# Altium project Codec_board.PrjPCB
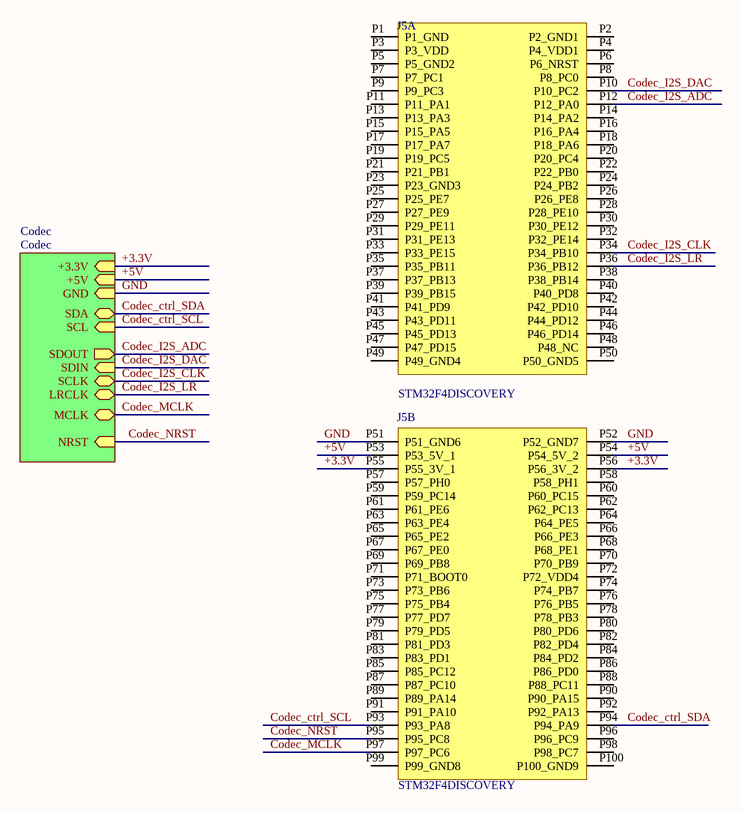
[diagram p0: Codec_board.SchDoc]
5 sheets, 116 parts. Net scope: hierarchical (ports join the sheet entries above them; power ports are global).
Board files: Codec_board_V0.PcbDoc, Codec_board.PcbDoc
Sheets:
  Codec_board.SchDoc
    Codec = Codec.SchDoc
      Input = Input_stage.SchDoc
      Output = Output_stage.SchDoc
      Power = Power_18.SchDoc

## Sheet Codec_board.SchDoc
size A0

### Parts
J5  STM32F4DISCOVERY  [STMICROELECTRONICS_STM32F4DISCOVERY_STM32F4DISCOVERY]  (parts A,B of 2)

### Sub-sheets
Codec = Codec: SDOUT (out), SCLK (bidir), MCLK (bidir), SDA (bidir), SCL (in), +3.3V (in), SDIN (in), GND (in), LRCLK (bidir), +5V (in), NRST (in)

### Nets
+3.3V: J5.P55(P55_3V_1) J5.P56(P56_3V_2) ; sheet Codec/+3.3V
+5V: J5.P53(P53_5V_1) J5.P54(P54_5V_2) ; sheet Codec/+5V
GND: J5.P51(P51_GND6) J5.P52(P52_GND7) ; sheet Codec/GND
Codec_ctrl_SCL: J5.P93(P93_PA8) ; sheet Codec/SCL
Codec_ctrl_SDA: J5.P94(P94_PA9) ; sheet Codec/SDA
Codec_I2S_ADC: J5.P12(P12_PA0) ; sheet Codec/SDOUT
Codec_I2S_CLK: J5.P34(P34_PB10) ; sheet Codec/SCLK
Codec_I2S_DAC: J5.P10(P10_PC2) ; sheet Codec/SDIN
Codec_I2S_LR: J5.P36(P36_PB12) ; sheet Codec/LRCLK
Codec_MCLK: J5.P97(P97_PC6) ; sheet Codec/MCLK
Codec_NRST: J5.P95(P95_PC8) ; sheet Codec/NRST

Not connected (* = marked no-connect by the designer): J5 P1(P1_GND) P2(P2_GND1) P3(P3_VDD) P4(P4_VDD1) P5(P5_GND2) P6(P6_NRST) P7(P7_PC1) P8(P8_PC0) P9(P9_PC3) P11(P11_PA1) P13(P13_PA3) P14(P14_PA2) P15(P15_PA5) P16(P16_PA4) P17(P17_PA7) P18(P18_PA6) P19(P19_PC5) P20(P20_PC4) P21(P21_PB1) P22(P22_PB0) P23(P23_GND3) P24(P24_PB2) P25(P25_PE7) P26(P26_PE8) P27(P27_PE9) P28(P28_PE10) P29(P29_PE11) P30(P30_PE12) P31(P31_PE13) P32(P32_PE14) P33(P33_PE15) P35(P35_PB11) P37(P37_PB13) P38(P38_PB14) P39(P39_PB15) P40(P40_PD8) P41(P41_PD9) P42(P42_PD10) P43(P43_PD11) P44(P44_PD12) P45(P45_PD13) P46(P46_PD14) P47(P47_PD15) P48(P48_NC) P49(P49_GND4) P50(P50_GND5) P57(P57_PH0) P58(P58_PH1) P59(P59_PC14) P60(P60_PC15) P61(P61_PE6) P62(P62_PC13) P63(P63_PE4) P64(P64_PE5) P65(P65_PE2) P66(P66_PE3) P67(P67_PE0) P68(P68_PE1) P69(P69_PB8) P70(P70_PB9) P71(P71_BOOT0) P72(P72_VDD4) P73(P73_PB6) P74(P74_PB7) P75(P75_PB4) P76(P76_PB5) P77(P77_PD7) P78(P78_PB3) P79(P79_PD5) P80(P80_PD6) P81(P81_PD3) P82(P82_PD4) P83(P83_PD1) P84(P84_PD2) P85(P85_PC12) P86(P86_PD0) P87(P87_PC10) P88(P88_PC11) P89(P89_PA14) P90(P90_PA15) P91(P91_PA10) P92(P92_PA13) P96(P96_PC9) P98(P98_PC7) P99(P99_GND8) P100(P100_GND9)

### Library data of the parts
J5 = STM32F4DISCOVERY: Development kit: ARM ST; pin strips, pin header; No.of; MF: STMicroelectronics; MP: STM32F4DISCOVERY; Availability: Unavailable; SnapEDA_Link: https://www.snapeda.com/parts/STM32F4DISCOVERY/STMicroelectronics/view-part/?ref=snap; Package: None; Price: None; Value: *

## Sheet Codec.SchDoc
size A0
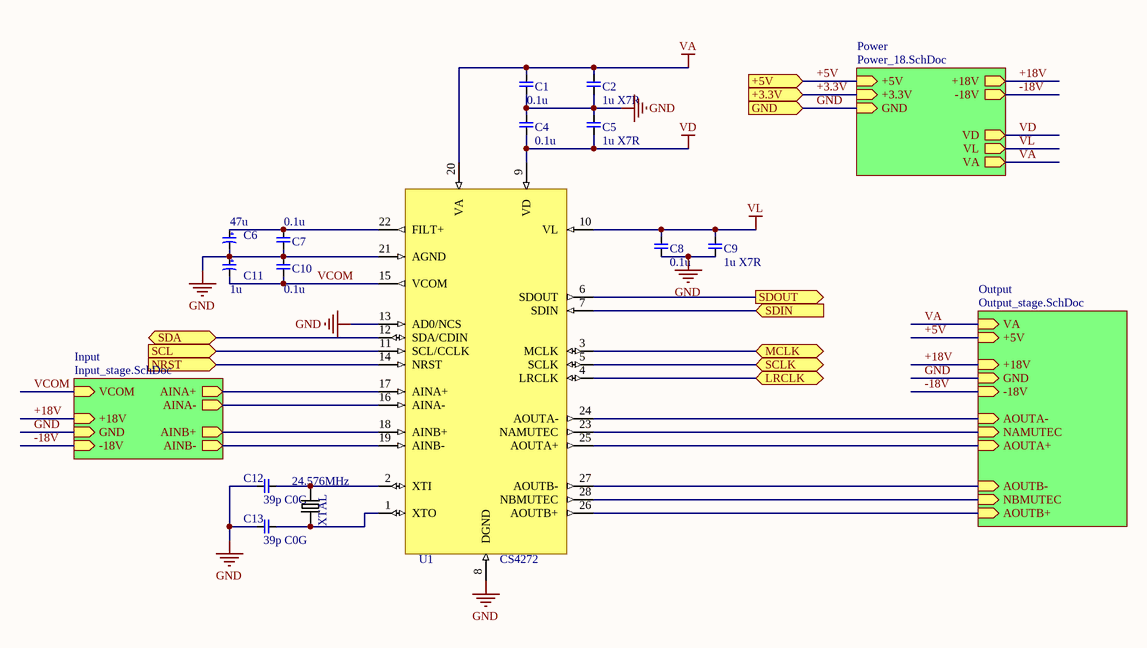
[diagram p1: Codec.SchDoc]

### Parts
24.576MHz  XTAL  [XTAL_hc-49_smd]
C1  0.1u  [0805_cap]
C2  1u X7R  [0805_cap]
C4  0.1u  [0805_cap]
C5  1u X7R  [0805_cap]
C6  47u  [cap 4x5.4]
C7  0.1u  [0805_cap]
C8  0.1u  [0805_cap]
C9  1u X7R  [0805_cap]
C10  0.1u  [0805_cap]
C11  1u  [cap 4x5.4]
C12  39p C0G  [0805_cap]
C13  39p C0G  [0805_cap]
U1  CS4272  [TSSOP-28]

### Sub-sheets
Input = Input_stage.SchDoc: AINA+ (out), AINB+ (out), +18V (in), GND (in), VCOM (in), AINB- (out), AINA- (out), -18V (in)
Output = Output_stage.SchDoc: NAMUTEC (in), AOUTA+ (in), -18V (in), GND (in), +5V (in), NBMUTEC (in), AOUTA- (in), VA (in), AOUTB- (in), +18V (in), AOUTB+ (in)
Power = Power_18.SchDoc: +3.3V (in), GND (in), -18V (out), +18V (out), VD (out), VL (out), VA (out), +5V (in)

### Ports
+3.3V (in), +5V (in), GND (in), LRCLK (bidir), MCLK (bidir), NRST (in), SCL (in), SCLK (bidir), SDA (bidir), SDIN (in), SDOUT (out)

### Nets
+3.3V: port +3.3V, sheet Power/+3.3V
+5V: C1.2 C2.2 U1.20(VA) ; port +5V, sheet Output/+5V, sheet Output/VA, sheet Power/VA, sheet Power/+5V  [also labelled VA]
+18V: sheet Input/+18V, sheet Output/+18V, sheet Power/+18V
-18V: sheet Input/-18V, sheet Output/-18V, sheet Power/-18V
GND: C1.1 C2.1 C4.2 C5.2 C6.2 C7.1 C8.1 C9.1 C10.2 C11.1 C12.1 C13.1 U1.8(DGND) U1.13(AD0/NCS) U1.21(AGND) ; port GND, sheet Input/GND, sheet Output/GND, sheet Power/GND
VD: C4.1 C5.1 U1.9(VD) ; sheet Power/VD
VL: C8.2 C9.2 U1.10(VL) ; sheet Power/VL
Codec_ctrl_SCL: U1.11(SCL/CCLK) ; port SCL
Codec_ctrl_SDA: U1.12(SDA/CDIN) ; port SDA
Codec_I2S_ADC: U1.6(SDOUT) ; port SDOUT
Codec_I2S_CLK: U1.5(SCLK) ; port SCLK
Codec_I2S_DAC: U1.7(SDIN) ; port SDIN
Codec_I2S_LR: U1.4(LRCLK) ; port LRCLK
Codec_MCLK: U1.3(MCLK) ; port MCLK
Codec_NRST: U1.14(NRST) ; port NRST
VCOM: C10.1 C11.2 U1.15(VCOM) ; sheet Input/VCOM
Net24.576MHz_1: 24.576MHz.1 C13.2 U1.1(XTO)
Net24.576MHz_2: 24.576MHz.2 C12.2 U1.2(XTI)
NetC6_1: C6.1 C7.2 U1.22(FILT+)
NetC17_1: U1.16(AINA-) ; sheet Input/AINA-
NetC17_2: U1.17(AINA+) ; sheet Input/AINA+
NetC25_1: U1.19(AINB-) ; sheet Input/AINB-
NetC25_2: U1.18(AINB+) ; sheet Input/AINB+
NetQ1_1: U1.23(NAMUTEC) ; sheet Output/NAMUTEC
NetQ3_1: U1.28(NBMUTEC) ; sheet Output/NBMUTEC
NetR18_1: U1.24(AOUTA-) ; sheet Output/AOUTA-
NetR21_1: U1.25(AOUTA+) ; sheet Output/AOUTA+
NetR29_1: U1.27(AOUTB-) ; sheet Output/AOUTB-
NetR32_1: U1.26(AOUTB+) ; sheet Output/AOUTB+

### Library data of the parts
24.576MHz = hc-49_smd: Crystal 4MHz ?30ppm (Tol) ?50ppm (Stability) 20pF FUND 200Ohm 2-Pin HC-49/SDLF SMD T/R; MP: FOXSDLF/040; MF: Fox Electronics; Availability: Good; Price: 0.34 USD; Package: HC49SD Fox Electronics; SnapEDA_Link: https://www.snapeda.com/symbols-footprints/FOXSDLF/040/Fox%20Electronics/view-part/?ref=snap; Value: *
C1 C2 C4 C5 C7-C10 C12 C13 = Cap
C6 C11 = Cap_electrolytic

## Sheet Input_stage.SchDoc
size A0
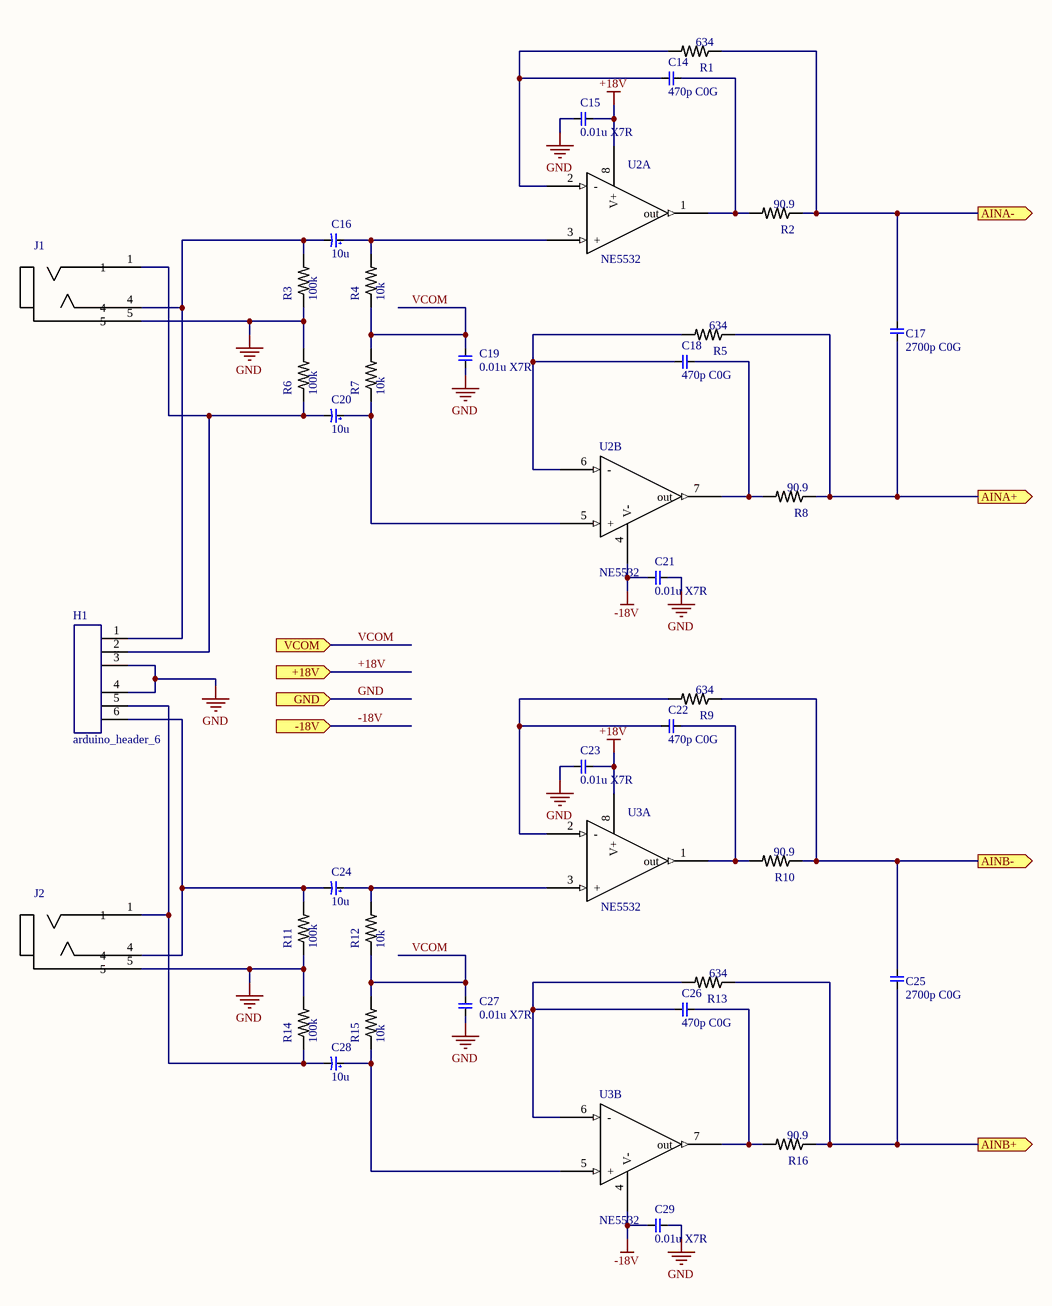
[diagram p2: Input_stage.SchDoc]

### Parts
C14  470p C0G  [0805_cap]
C15  0.01u X7R  [0805_cap]
C16  10u  [cap 4x5.4]
C17  2700p C0G  [0805_cap]
C18  470p C0G  [0805_cap]
C19  0.01u X7R  [0805_cap]
C20  10u  [cap 4x5.4]
C21  0.01u X7R  [0805_cap]
C22  470p C0G  [0805_cap]
C23  0.01u X7R  [0805_cap]
C24  10u  [cap 4x5.4]
C25  2700p C0G  [0805_cap]
C26  470p C0G  [0805_cap]
C27  0.01u X7R  [0805_cap]
C28  10u  [cap 4x5.4]
C29  0.01u X7R  [0805_cap]
H1  arduino_header_6  [header-6_male]
J1  35RASMT2BHNTRX  [SWITCHCRAFT_35RASMT2BHNTRX]  (value not drawn)
J2  35RASMT2BHNTRX  [SWITCHCRAFT_35RASMT2BHNTRX]  (value not drawn)
R1  634  [0805]
R2  90.9  [0805]
R3  100k  [0805]
R4  10k  [0805]
R5  634  [0805]
R6  100k  [0805]
R7  10k  [0805]
R8  90.9  [0805]
R9  634  [0805]
R10  90.9  [0805]
R11  100k  [0805]
R12  10k  [0805]
R13  634  [0805]
R14  100k  [0805]
R15  10k  [0805]
R16  90.9  [0805]
U2  NE5532  [SOIC-8]  (parts A,B of 2)
U3  NE5532  [SOIC-8]  (parts A,B of 2)

### Ports
+18V (in), -18V (in), AINA+ (out), AINA- (out), AINB+ (out), AINB- (out), GND (in), VCOM (in)

### Nets
+18V: C15.2 C23.2 U2.8(V+) U3.8(V+) ; port +18V
-18V: C21.2 C29.2 U2.4(V-) U3.4(V-) ; port -18V
GND: C15.1 C19.1 C21.1 C23.1 C27.1 C29.1 H1.3 H1.4 J1.5 J2.5 R3.1 R6.2 R11.1 R14.2 ; port GND
VCOM: C19.2 C27.2 R4.1 R7.2 R12.1 R15.2 ; port VCOM
NetC14_1: C14.1 R2.2 U2.1(out)
NetC14_2: C14.2 R1.2 U2.2(-)
NetC16_1: C16.1 R4.2 U2.3(+)
NetC16_2: C16.2 H1.1 J1.4 R3.2
NetC17_1: C17.1 R1.1 R2.1 ; port AINA-
NetC17_2: C17.2 R5.1 R8.1 ; port AINA+
NetC18_1: C18.1 R8.2 U2.7(out)
NetC18_2: C18.2 R5.2 U2.6(-)
NetC20_1: C20.1 R7.1 U2.5(+)
NetC20_2: C20.2 H1.2 J1.1 R6.1
NetC22_1: C22.1 R10.2 U3.1(out)
NetC22_2: C22.2 R9.2 U3.2(-)
NetC24_1: C24.1 R12.2 U3.3(+)
NetC24_2: C24.2 H1.6 J2.4 R11.2
NetC25_1: C25.1 R9.1 R10.1 ; port AINB-
NetC25_2: C25.2 R13.1 R16.1 ; port AINB+
NetC26_1: C26.1 R16.2 U3.7(out)
NetC26_2: C26.2 R13.2 U3.6(-)
NetC28_1: C28.1 R15.1 U3.5(+)
NetC28_2: C28.2 H1.5 J2.1 R14.1

### Library data of the parts
C14 C15 C17-C19 C21-C23 C25-C27 C29 = Cap
C16 C20 C24 C28 = Cap_electrolytic
J1 J2 = 3.5mm jack stereo smd: Conn 3.5MM Stereo Jack F 3 POS Solder RA SMD 3 Terminal 1 Port T/R; MF: Switchcraft; MP: 35RASMT2BHNTRX; Package: None; Price: 0.84 USD; Availability: Good; SnapEDA_Link: https://www.snapeda.com/parts/35RASMT2BHNTRX/Switchcraft%20Inc./view-part/?ref=snap; Value: *
R1-R16 = res my: RES SMD  1/8W 0805; MF: Yageo; MP: AC0805JR-070RL; Package: 0805 Yageo; Price: 0.01 USD; Availability: Good; Value: *
U2 U3 = OPA2277

## Sheet Output_stage.SchDoc
size A0
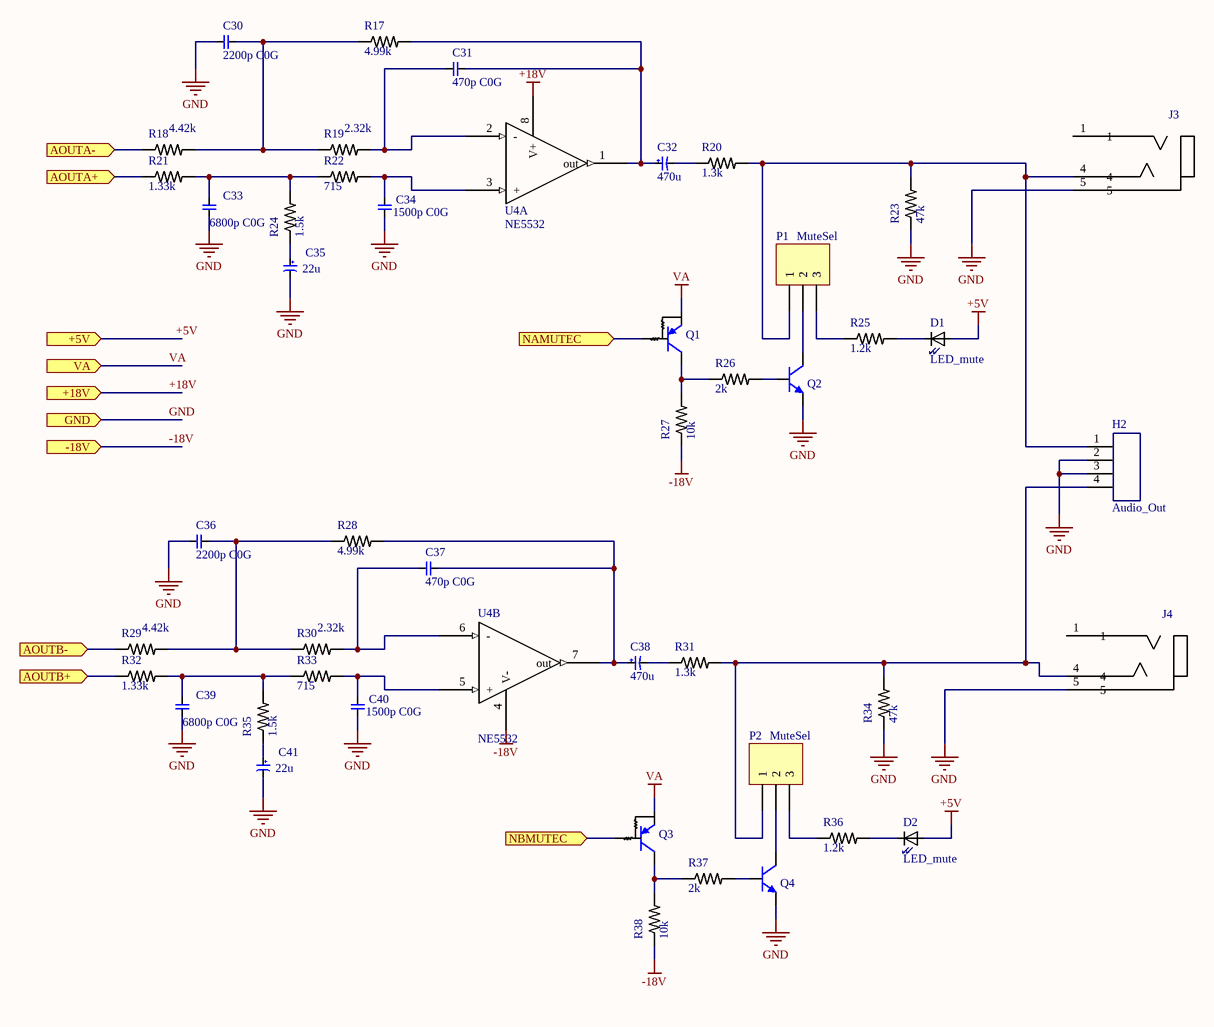
[diagram p3: Output_stage.SchDoc]

### Parts
C30  2200p C0G  [0805_cap]
C31  470p C0G  [0805_cap]
C32  470u  [cap 4x5.4]
C33  6800p C0G  [0805_cap]
C34  1500p C0G  [0805_cap]
C35  22u  [cap 4x5.4]
C36  2200p C0G  [0805_cap]
C37  470p C0G  [0805_cap]
C38  470u  [cap 4x5.4]
C39  6800p C0G  [0805_cap]
C40  1500p C0G  [0805_cap]
C41  22u  [cap 4x5.4]
D1  LED_mute  [1206]
D2  LED_mute  [1206]
H2  Audio_Out  [header-4_male]
J3  35RASMT2BHNTRX  [SWITCHCRAFT_35RASMT2BHNTRX]  (value not drawn)
J4  35RASMT2BHNTRX  [SWITCHCRAFT_35RASMT2BHNTRX]  (value not drawn)
P1  MuteSel  [HDR1X3]
P2  MuteSel  [HDR1X3]
Q1  MMUN2111LT1G  [SOT-23]  (value not drawn)
Q2  MMBT5551  [SOT-23]  (value not drawn)
Q3  MMUN2111LT1G  [SOT-23]  (value not drawn)
Q4  MMBT5551  [SOT-23]  (value not drawn)
R17  4.99k  [0805]
R18  4.42k  [0805]
R19  2.32k  [0805]
R20  1.3k  [0805]
R21  1.33k  [0805]
R22  715  [0805]
R23  47k  [0805]
R24  1.5k  [0805]
R25  1.2k  [0805]
R26  2k  [0805]
R27  10k  [0805]
R28  4.99k  [0805]
R29  4.42k  [0805]
R30  2.32k  [0805]
R31  1.3k  [0805]
R32  1.33k  [0805]
R33  715  [0805]
R34  47k  [0805]
R35  1.5k  [0805]
R36  1.2k  [0805]
R37  2k  [0805]
R38  10k  [0805]
U4  NE5532  [SOIC-8]  (parts A,B of 2)

### Ports
+5V (in), +18V (in), -18V (in), AOUTA+ (in), AOUTA- (in), AOUTB+ (in), AOUTB- (in), GND (in), NAMUTEC (in), NBMUTEC (in), VA (in)

### Nets
+5V: D1.1 D2.1 Q1.2(E) Q3.2(E) ; port +5V, port VA  [also labelled VA]
+18V: U4.8(V+) ; port +18V
-18V: R27.1 R38.1 U4.4(V-) ; port -18V
GND: C30.2 C33.1 C34.1 C35.2 C36.2 C39.1 C40.1 C41.2 H2.2 H2.3 J3.5 J4.5 Q2.2(E) Q4.2(E) R23.1 R34.1 ; port GND
NetC30_1: C30.1 R17.1 R18.2 R19.1
NetC31_1: C31.1 C32.1 R17.2 U4.1(out)
NetC31_2: C31.2 R19.2 U4.2(-)
NetC32_2: C32.2 R20.1
NetC33_2: C33.2 R21.2 R22.1 R24.2
NetC34_2: C34.2 R22.2 U4.3(+)
NetC35_1: C35.1 R24.1
NetC36_1: C36.1 R28.1 R29.2 R30.1
NetC37_1: C37.1 C38.1 R28.2 U4.7(out)
NetC37_2: C37.2 R30.2 U4.6(-)
NetC38_2: C38.2 R31.1
NetC39_2: C39.2 R32.2 R33.1 R35.2
NetC40_2: C40.2 R33.2 U4.5(+)
NetC41_1: C41.1 R35.1
NetD1_2: D1.2 R25.2
NetD2_2: D2.2 R36.2
NetH2_1: H2.1 J3.4 P1.1 R20.2 R23.2
NetH2_4: H2.4 J4.4 P2.1 R31.2 R34.2
NetP1_2: P1.2 Q2.3(C)
NetP1_3: P1.3 R25.1
NetP2_2: P2.2 Q4.3(C)
NetP2_3: P2.3 R36.1
NetQ1_1: Q1.1(B) ; port NAMUTEC
NetQ1_3: Q1.3(C) R26.1 R27.2
NetQ2_1: Q2.1(B) R26.2
NetQ3_1: Q3.1(B) ; port NBMUTEC
NetQ3_3: Q3.3(C) R37.1 R38.2
NetQ4_1: Q4.1(B) R37.2
NetR18_1: R18.1 ; port AOUTA-
NetR21_1: R21.1 ; port AOUTA+
NetR29_1: R29.1 ; port AOUTB-
NetR32_1: R32.1 ; port AOUTB+

Not connected (* = marked no-connect by the designer): J3 1; J4 1

### Library data of the parts
C30 C31 C33 C34 C36 C37 C39 C40 = Cap
C32 C35 C38 C41 = Cap_electrolytic
D1 D2 = LED
H2 = arduino_header_4
J3 J4 = 3.5mm jack stereo smd: as J1 on sheet Input_stage; MP: 35RASMT2BHNTRX; Package: None; Price: 0.84 USD; Availability: Good; SnapEDA_Link: https://www.snapeda.com/parts/35RASMT2BHNTRX/Switchcraft%20Inc./view-part/?ref=snap; Value: *
P1 P2 = Header 3: Header, 3-Pin; LatestRevisionDate: 17-Jul-2002; LatestRevisionNote: Re-released for DXP Platform.; Publisher: Altium Limited
R17-R38 = res my: as R1 on sheet Input_stage; Package: 0805 Yageo; Price: 0.01 USD; Availability: Good; Value: *
U4 = OPA2277

## Sheet Power_18.SchDoc
size A0
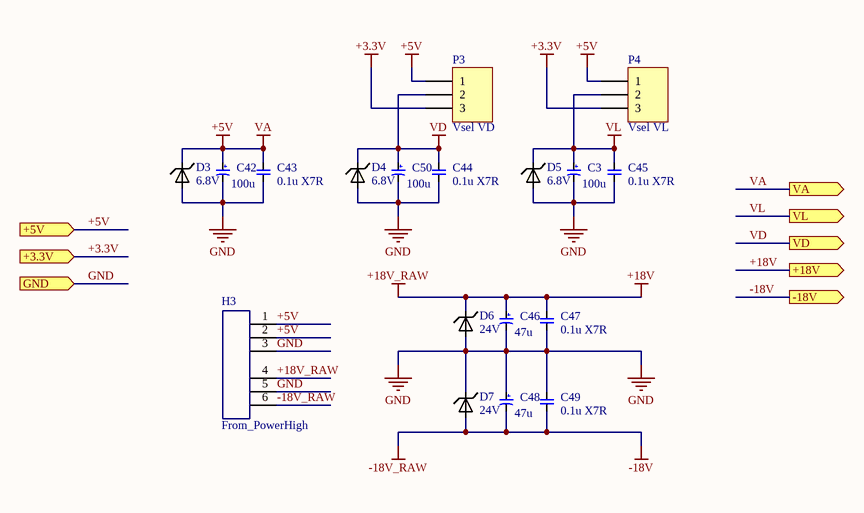
[diagram p4: Power_18.SchDoc]

### Parts
C3  100u  [cap 4x5.4]
C42  100u  [cap 4x5.4]
C43  0.1u X7R  [0805_cap]
C44  0.1u X7R  [0805_cap]
C45  0.1u X7R  [0805_cap]
C46  47u  [cap 4x5.4]
C47  0.1u X7R  [0805_cap]
C48  47u  [cap 4x5.4]
C49  0.1u X7R  [0805_cap]
C50  100u  [cap 4x5.4]
D3  6.8V  [SOD-80]
D4  6.8V  [SOD-80]
D5  6.8V  [SOD-80]
D6  24V  [SOD-80]
D7  24V  [SOD-80]
H3  From_PowerHigh  [header-6_male]
P3  Vsel VD  [HDR1X3]
P4  Vsel VL  [HDR1X3]

### Ports
+3.3V (in), +5V (in), +18V (out), -18V (out), GND (in), VA (out), VD (out), VL (out)

### Nets
+3.3V: P3.3 P4.3 ; port +3.3V
+5V: C42.1 C43.2 D3.C H3.1 H3.2 P3.1 P4.1 ; port +5V, port VA  [also labelled VA]
+18V: C46.1 C47.2 D6.C H3.4 ; port +18V  [also labelled +18V_RAW]
-18V: C48.2 C49.1 D7.A H3.6 ; port -18V  [also labelled -18V_RAW]
GND: C3.2 C42.2 C43.1 C44.1 C45.1 C46.2 C47.1 C48.1 C49.2 C50.2 D3.A D4.A D5.A D6.A D7.C H3.3 H3.5 ; port GND
VD: C44.2 C50.1 D4.C P3.2 ; port VD
VL: C3.1 C45.2 D5.C P4.2 ; port VL

### Library data of the parts
C3 C42 C46 C48 C50 = Cap_electrolytic
C43-C45 C47 C49 = Cap
D3-D7 = Stabilitron
H3 = arduino_header_6
P3 P4 = Header 3: Header, 3-Pin; LatestRevisionDate: 17-Jul-2002; LatestRevisionNote: Re-released for DXP Platform.; Publisher: Altium Limited

## Nets that join several sheets
+3.3V: Codec_board (J5.P55 J5.P56), Power_18 (P3.3 P4.3)
+5V: Codec_board (J5.P53 J5.P54), Codec (C1.2 C2.2 U1.20), Output_stage (D1.1 D2.1 Q1.2 Q3.2), Power_18 (7 pins)
+18V: Input_stage (C15.2 C23.2 U2.8 U3.8), Output_stage (U4.8), Power_18 (C46.1 C47.2 D6.C H3.4)
-18V: Input_stage (C21.2 C29.2 U2.4 U3.4), Output_stage (R27.1 R38.1 U4.4), Power_18 (C48.2 C49.1 D7.A H3.6)
GND: Codec_board (J5.P51 J5.P52), Codec (15 pins), Input_stage (14 pins), Output_stage (16 pins), Power_18 (17 pins)
VD: Codec (C4.1 C5.1 U1.9), Power_18 (C44.2 C50.1 D4.C P3.2)
VL: Codec (C8.2 C9.2 U1.10), Power_18 (C3.1 C45.2 D5.C P4.2)
Codec_ctrl_SCL: Codec_board (J5.P93), Codec (U1.11)
Codec_ctrl_SDA: Codec_board (J5.P94), Codec (U1.12)
Codec_I2S_ADC: Codec_board (J5.P12), Codec (U1.6)
Codec_I2S_CLK: Codec_board (J5.P34), Codec (U1.5)
Codec_I2S_DAC: Codec_board (J5.P10), Codec (U1.7)
Codec_I2S_LR: Codec_board (J5.P36), Codec (U1.4)
Codec_MCLK: Codec_board (J5.P97), Codec (U1.3)
Codec_NRST: Codec_board (J5.P95), Codec (U1.14)
NetC17_1: Codec (U1.16), Input_stage (C17.1 R1.1 R2.1)
NetC17_2: Codec (U1.17), Input_stage (C17.2 R5.1 R8.1)
NetC25_1: Codec (U1.19), Input_stage (C25.1 R9.1 R10.1)
NetC25_2: Codec (U1.18), Input_stage (C25.2 R13.1 R16.1)
NetQ1_1: Codec (U1.23), Output_stage (Q1.1)
NetQ3_1: Codec (U1.28), Output_stage (Q3.1)
NetR18_1: Codec (U1.24), Output_stage (R18.1)
NetR21_1: Codec (U1.25), Output_stage (R21.1)
NetR29_1: Codec (U1.27), Output_stage (R29.1)
NetR32_1: Codec (U1.26), Output_stage (R32.1)
VCOM: Codec (C10.1 C11.2 U1.15), Input_stage (6 pins)